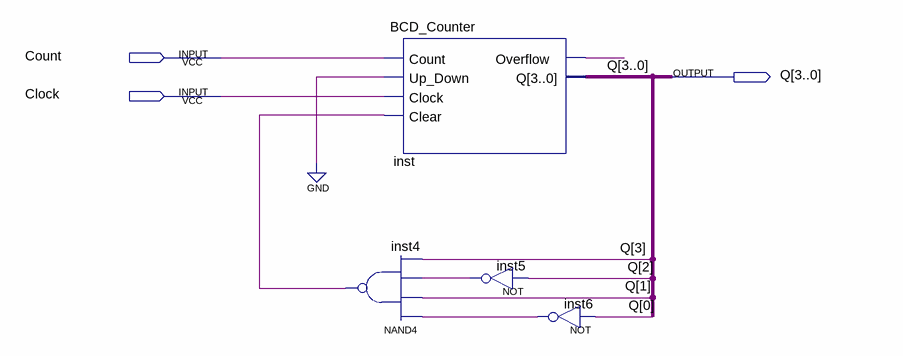
[diagram p0: schematic sheet]
// Quartus schematic Counter.bdf as structural Verilog: 4 symbols, 3 pins
module Counter (
  input  Count,
  input  Clock,
  output [3:0] Q
);

  wire inst4_out, inst5_out, inst6_out, inst_overflow;

  BCD_Counter inst (.Count(Count), .Up_Down(1'b0), .Clock(Clock), .Clear(inst4_out), .Overflow(inst_overflow), .Q(Q));
  nand inst4 (inst4_out, inst6_out, Q[1], inst5_out, Q[3]);
  not inst5 (inst5_out, Q[2]);
  not inst6 (inst6_out, Q[0]);
endmodule
